# Altium schematic sheet FLS ADC_A POWER SUPPLY.SchDoc
size 558 x 401 mm; Organization: Carnegie Institution of Washington; SheetNumber: 0; SheetTotal: 0; PageSetup: Record=PageOptions|CenterHorizontal=True|CenterVertical=True|PrintScale=0.47|XCorrection=1.00|YCorrection=1.00|PrintKind=1|BorderSize=5000000|LeftOffset=0|BottomOffset=0|Orientation=2|PaperLength=1000|PaperWidth=1000|Scale=100|PaperSource=259|PrintQuality=600|MediaType=1|DitherType=10|PaperKind=Letter (8.5 x 11")|PrintScaleMode=1
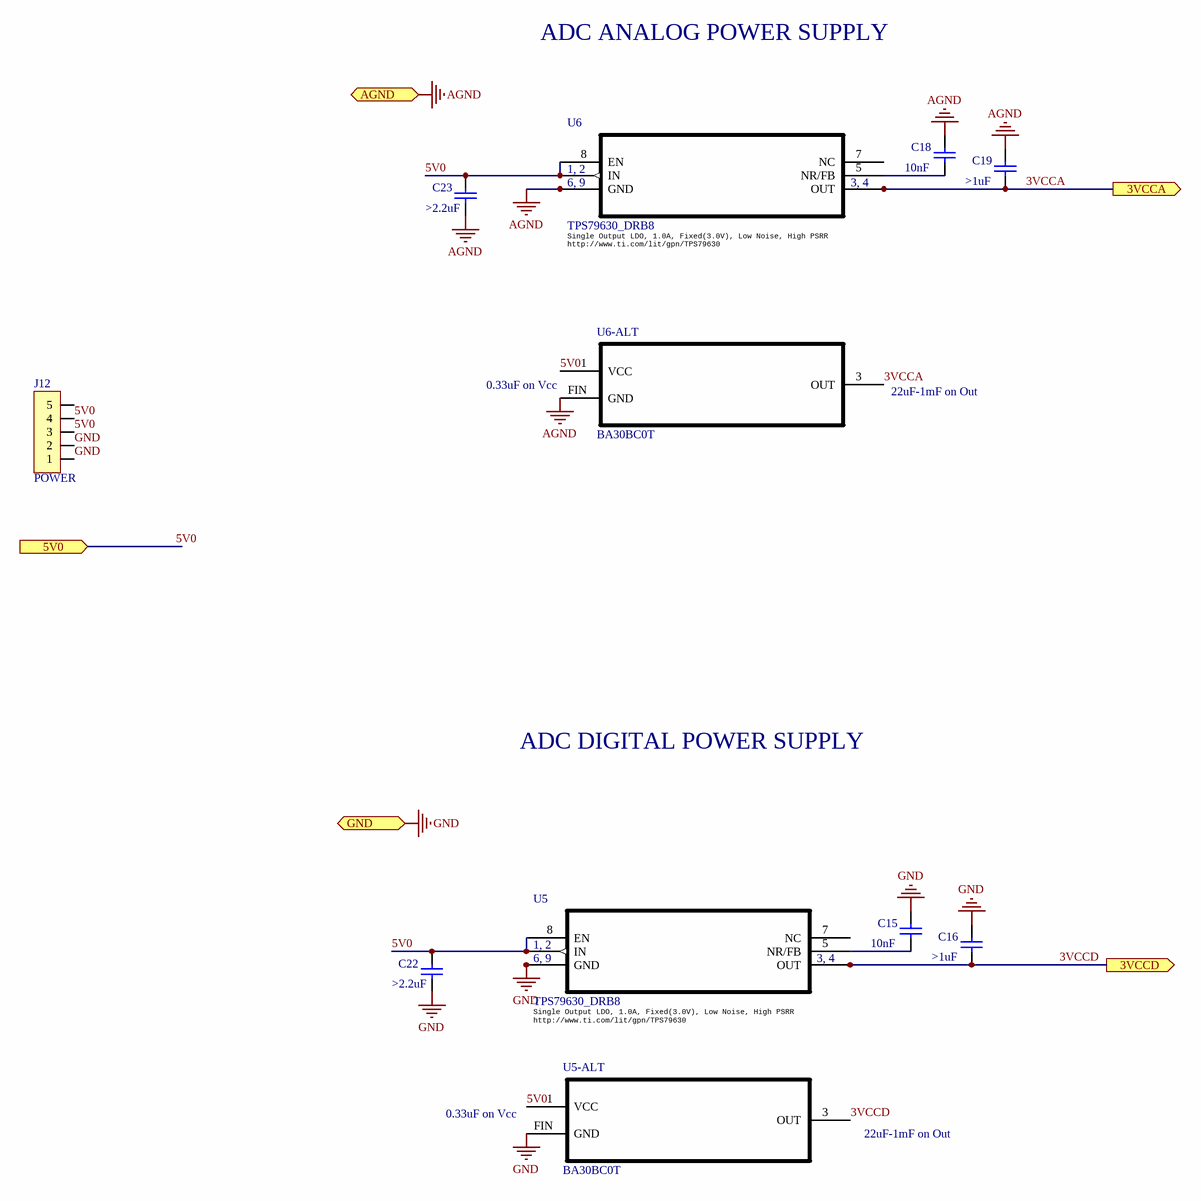
[diagram p0: FLS ADC_A POWER SUPPLY.SchDoc]

## Parts
C15  value 10nF  [1608[0603]]  (hidden comment: 0.1uF)
C16  value >1uF  [0805 slim outer]  (hidden comment: 0.1uF)
C18  value 10nF  [1608[0603]]  (hidden comment: 0.1uF)
C19  value >1uF  [0805 slim outer]  (hidden comment: 0.1uF)
C22  value >2.2uF  [1608[0603]]  (hidden comment: 0.1uF)
C23  value >2.2uF  [1608[0603]]  (hidden comment: 0.1uF)
J12  POWER  [SIP5]
U5  TPS79630_DRB8  DESCRIPTION: Single Output LDO, 1.0A, Fixed(3.0V), Low Noise, High PSRR  [DRB8_2P4X1P65]
U5-ALT  BA30BC0T  [TO252-3]
U6  TPS79630_DRB8  DESCRIPTION: Single Output LDO, 1.0A, Fixed(3.0V), Low Noise, High PSRR  [DRB8_2P4X1P65]
U6-ALT  BA30BC0T  [TO252-3]

## Ports
3VCCA (out), 3VCCD (out), 5V0 (in), AGND (in), GND (in)

## Nets
AGND: C18.2 C19.2 C23.1 U6.6(GND) U6.9 U6.V_1 U6.V_2 U6.V_3 U6.V_4 U6.V_5 U6.V_6 U6-ALT.FIN(GND) ; port AGND
GND: C15.2 C16.2 C22.1 J12.1 J12.2 U5.6(GND) U5.9 U5.V_1 U5.V_2 U5.V_3 U5.V_4 U5.V_5 U5.V_6 U5-ALT.FIN(GND) ; port GND
3VCCA: C19.1 U6.3(OUT) U6.4(OUT) U6-ALT.3(OUT) ; port 3VCCA
3VCCD: C16.1 U5.3(OUT) U5.4(OUT) U5-ALT.3(OUT) ; port 3VCCD
5V0: C22.2 C23.2 J12.3 J12.4 U5.1(IN) U5.2(IN) U5.8(EN) U5-ALT.1(VCC) U6.1(IN) U6.2(IN) U6.8(EN) U6-ALT.1(VCC) ; port 5V0
NetC15_1: C15.1 U5.5(NR/FB)
NetC18_1: C18.1 U6.5(NR/FB)

Not connected (* = marked no-connect by the designer): J12 5; U5 7(NC); U6 7(NC)

## Notes on the sheet
- ADC ANALOG POWER SUPPLY
- (near U6-ALT) 0.33uF on Vcc
- (near U6-ALT) 22uF-1mF on Out
- ADC DIGITAL POWER SUPPLY
- (near U5-ALT) 0.33uF on Vcc
- 22uF-1mF on Out
- Carnegie Institution of Washington
- 813 Santa Barbara Street
- The Observatories
- PHONE (626) 577-1122               FAX (626) 795-8136
- Pasadena, California 91101
- Title:
- OCIW
- Size:
- Date:
- C
- Scale:
- Drawn By:
- Checked By:
- A. BAGISH
- alanb
- Revision:
- Sheet          of
- File:
- (in symbol TPS79630_DRB8) 1, 2; 6, 9; 3, 4

## Library data of the parts
C15 C16 C18 C19 C22 C23 = Cap: Capacitor; Taiyo Yuden: UMK212B7224KG-T; Description: CAP CER 0.22UF 50V 10% X7R 0805; Published: 8-Jun-2000; LatestRevisionDate: 17-Jul-2002; LatestRevisionNote: Re-released for DXP Platform.; PackageReference: 0805 (2012 Metric); Publisher: Altium Limited; Digi-Key Part Number: 587-1287-6-ND
J12 = CON5
U5 U6 = TPS79630_DRB8: Imported; Datasheet URL: http://www.ti.com/lit/gpn/TPS79630